# EAGLE board WM1302_915_SPI_without SX1262_SKY66420_v1.3 (EAGLE 6.4), part 1 of 2
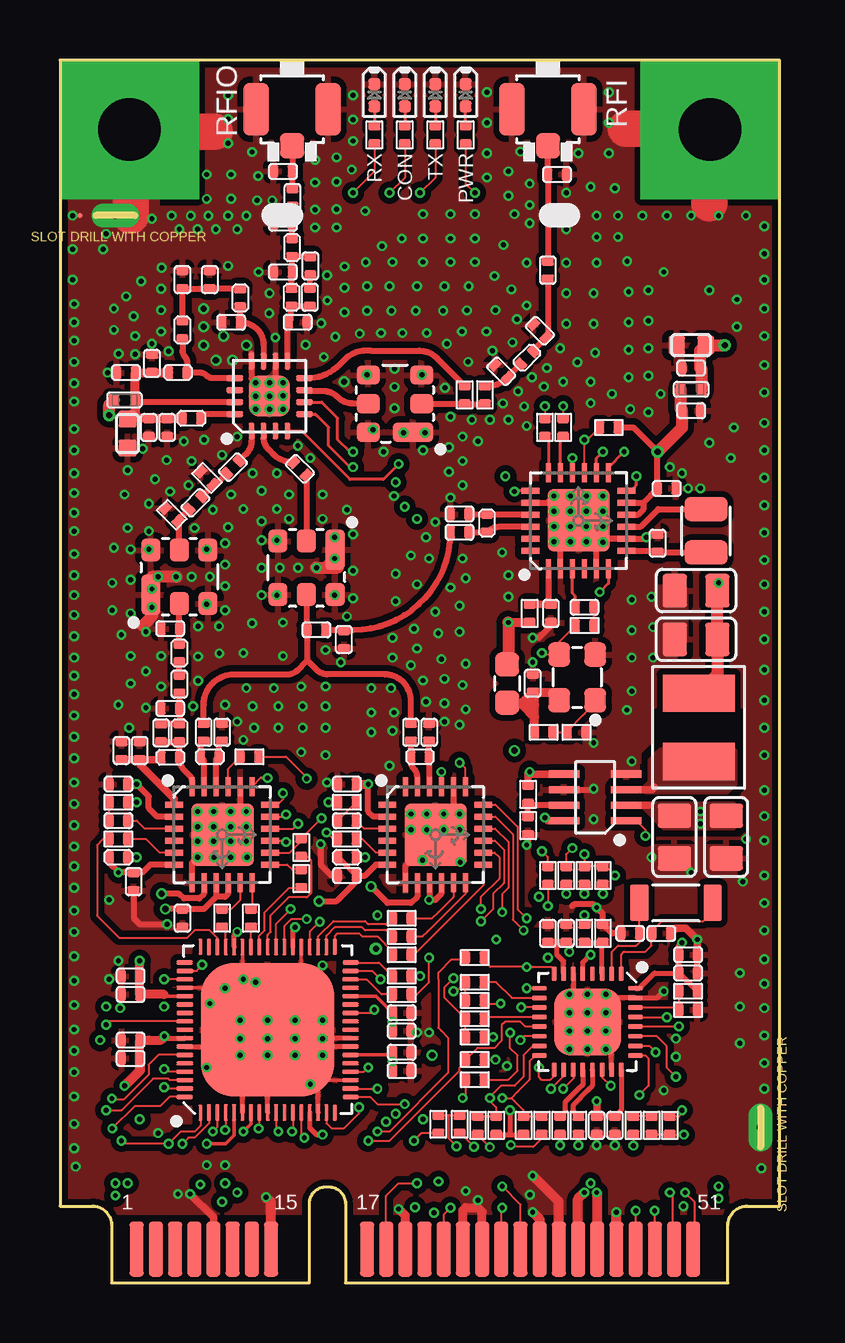
[diagram p5: board, top side]
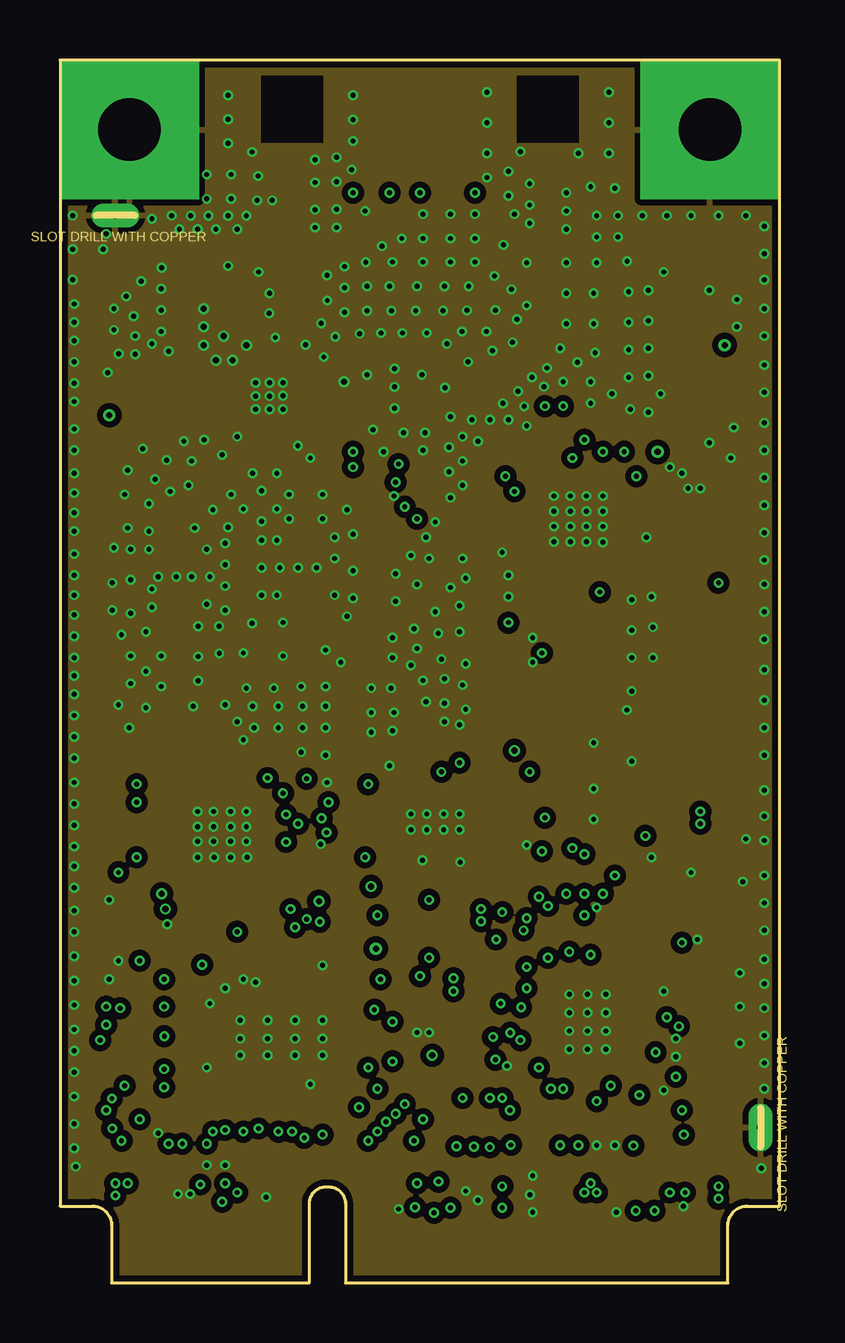
[diagram p6: board, inner layer GND2]
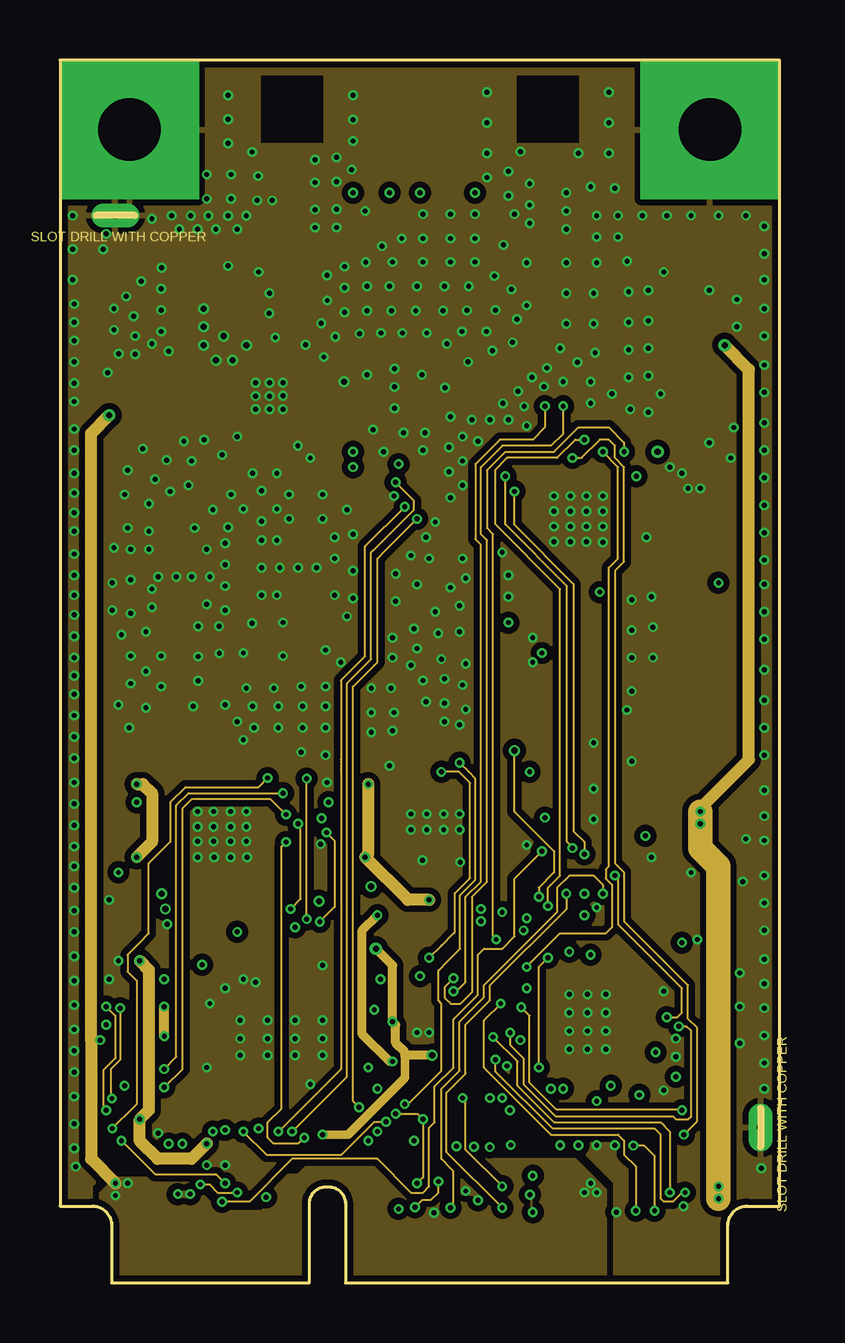
[diagram p7: board, inner layer PWR15]
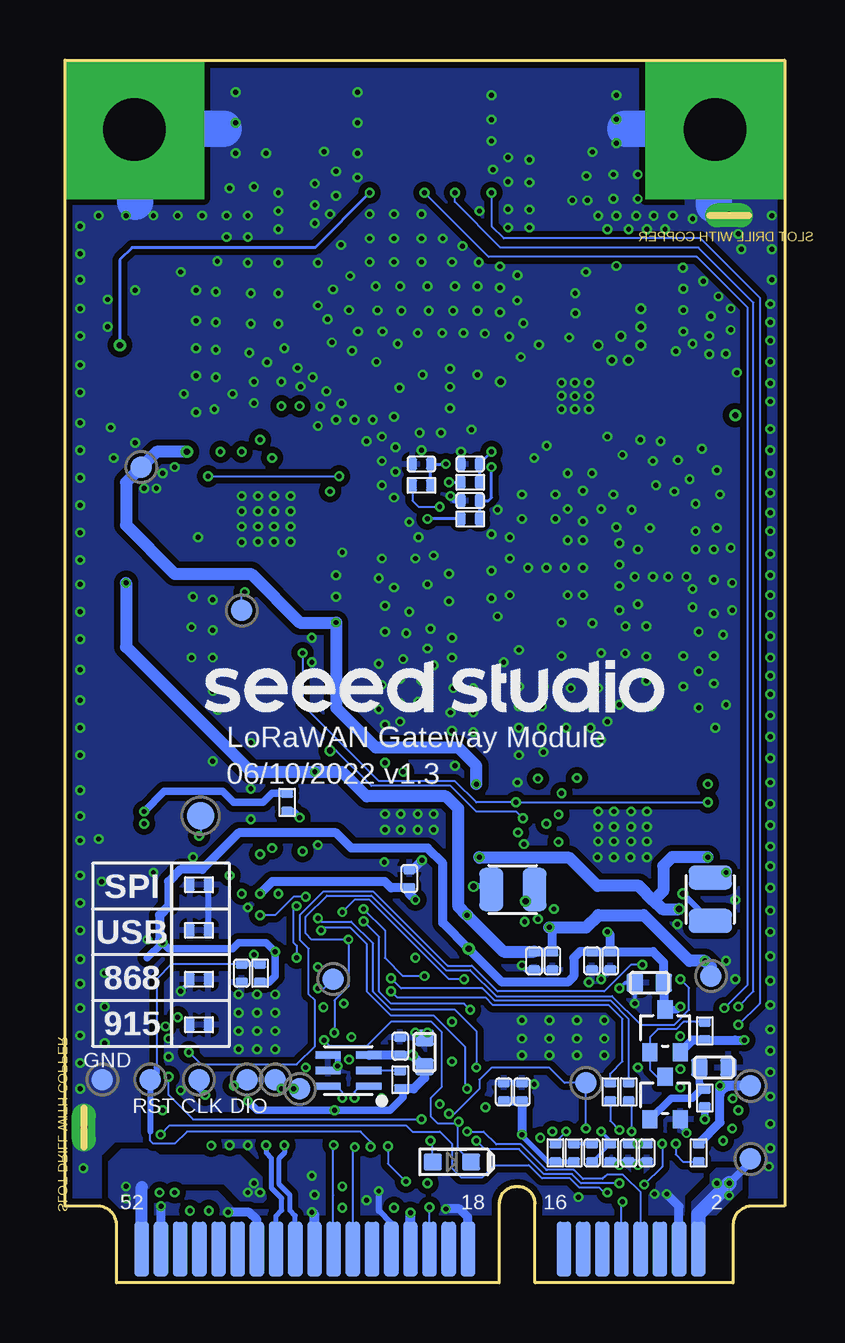
[diagram p8: board, bottom side, seen from below]

Size 30 x 50.95 mm. Coordinates in mm from the lower left corner, seen from the top.
Copper layers (1*2*15*16): Top 0.035mm / dielectric 0.2mm / GND2 0.0175mm / dielectric 0.3mm / PWR15 0.0175mm / dielectric 0.2mm / Bottom 0.035mm
Design rules "SeeedStudio_4layer_DRU_no_angle_20140221 *": minimum track width 1mil, minimum drill 8mil, track to track 3.5mil, track to pad 3.5mil, pad to pad 3.5mil, via to via 3.5mil, smd to smd 0mil, copper to edge 10mil, drill to drill 8mil, minimum pad ring 4mil, minimum via ring 4mil, stop-mask expansion 4mil, vias tented up to drill 25mil, thermal gap 10mil
tRestrict: area 24.9,22.6 to 28.3,23.7; area 20.7,24.1 to 22.4,26.4; area 11.8,9.9 to 12.4,10.1; area 2.1,0 to 27.9,2.6
bRestrict: area 2.1,0 to 27.9,2.6
Milling: area -32.6,37.2 to -23.1,39.1; area -32.6,33.4 to -23.1,36.5; area -32.6,30.8 to -23.1,32.7; 6 lines

## Footprints (pad centres in the part's own frame; a part is rotated, then mirrored left to right if it is on the bottom)
U-FL3P-SMD-2.6X2.6X1.0MM = smd 1.05 x 1: D -1.524,0 | smd 2.2 x 1.05: GND1 0,1.5; GND2 0,-1.5
C0402 = smd 0.385 x 0.508: 1 0.383,0; 2 -0.383,0
C0603 = smd 0.696 x 0.762: 1 0.602,0; 2 -0.602,0
C0805 = smd 1.016 x 1.397: 1 -0.889,0; 2 0.889,0
LED-0402 = smd 0.5 x 0.5: + 0.463,0; - -0.463,0
ESD-0402 = smd 0.385 x 0.508: 1 0.383,0; 2 -0.383,0
SOD-523 = smd 0.762 x 0.7: + 0.8,0; - -0.8,0
F0402 = smd 0.445 x 0.508: 1 -0.445,0; 2 0.445,0
PCIE52P-0.8-50.95X30MM = smd 0.6 x 2.3: 1 0,0; 3 0.8,0; 5 1.6,0; 7 2.4,0; 9 3.2,0; 11 4,0; 13 4.8,0; 15 5.6,0; 17 9.6,0; 19 10.4,0; 21 11.2,0; 23 12,0; 25 12.8,0; 27 13.6,0; 29 14.4,0; 31 15.2,0; 33 16,0; 35 16.8,0; 37 17.6,0; 39 18.4,0; 41 19.2,0; 43 20,0; 45 20.8,0; 47 21.6,0; 49 22.4,0; 51 23.2,0 | smd 0.6 x 2.3 bottom: 2 0.4,0; 4 1.2,0; 6 2,0; 8 2.8,0; 10 3.6,0; 12 4.4,0; 14 5.2,0; 16 6,0; 18 10,0; 20 10.8,0; 22 11.6,0; 24 12.4,0; 26 13.2,0; 28 14,0; 30 14.8,0; 32 15.6,0; 34 16.4,0; 36 17.2,0; 38 18,0; 40 18.8,0; 42 19.6,0; 44 20.4,0; 46 21.2,0; 48 22,0; 50 22.8,0; 52 23.6,0 | drill 2.6 pad 5.8 square: S1 -0.3,46.65; S2 23.9,46.65
L0402 = smd 0.385 x 0.508: 1 0.383,0; 2 -0.383,0
F0603 = smd 1 x 1: 1 -0.8,0; 2 0.8,0
L4.4X3.0MM = smd 1.55 x 3: 1 -1.425,0; 2 1.425,0
L202012 = smd 1 x 1.8: 1 -0.9,0; 2 0.9,0
SOT-323 = smd 0.762 x 0.635: 1 0.889,-0.635; 2 0.889,0.635; 3 -0.889,0
R0402 = smd 0.385 x 0.508: 1 0.383,0; 2 -0.383,0
SHIELD_1302 = smd 0.2 x 0.2: 1 -14.179,19.734
TP_3535 = smd 0.889 x 0.889: T 0,0
TP-D45MIL = smd 1.143 x 1.143: T 0,0
TEST-1.9X0.3MM = drill 0.3 pad 1 long: 1 0,0
QFN68-0.35-7X7X0.75MM = smd 0.68 x 0.18: 1 -3.46,2.8; 17 -3.46,-2.8; 35 3.46,-2.8; 51 3.46,2.8 | smd 0.7 x 0.18: 2 -3.45,2.45; 3 -3.45,2.1; 4 -3.45,1.75; 5 -3.45,1.4; 6 -3.45,1.05; 7 -3.45,0.7; 8 -3.45,0.35; 9 -3.45,0; 10 -3.45,-0.35; 11 -3.45,-0.7; 12 -3.45,-1.05; 13 -3.45,-1.4; 14 -3.45,-1.75; 15 -3.45,-2.1; 16 -3.45,-2.45; 36 3.45,-2.45; 37 3.45,-2.1; 38 3.45,-1.75; 39 3.45,-1.4; 40 3.45,-1.05; 41 3.45,-0.7; 42 3.45,-0.35; 43 3.45,0; 44 3.45,0.35; 45 3.45,0.7; 46 3.45,1.05; 47 3.45,1.4; 48 3.45,1.75; 49 3.45,2.1; 50 3.45,2.45 | smd 0.18 x 0.68: 18 -2.8,-3.46; 34 2.8,-3.46; 52 2.8,3.46; 68 -2.8,3.46 | smd 0.18 x 0.7: 19 -2.45,-3.45; 20 -2.1,-3.45; 21 -1.75,-3.45; 22 -1.4,-3.45; 23 -1.05,-3.45; 24 -0.7,-3.45; 25 -0.35,-3.45; 26 0,-3.45; 27 0.35,-3.45; 28 0.7,-3.45; 29 1.05,-3.45; 30 1.4,-3.45; 31 1.75,-3.45; 32 2.1,-3.45; 33 2.45,-3.45; 53 2.45,3.45; 54 2.1,3.45; 55 1.75,3.45; 56 1.4,3.45; 57 1.05,3.45; 58 0.7,3.45; 59 0.35,3.45; 60 0,3.45; 61 -0.35,3.45; 62 -0.7,3.45; 63 -1.05,3.45; 64 -1.4,3.45; 65 -1.75,3.45; 66 -2.1,3.45; 67 -2.45,3.45 | smd 5.56 x 5.56: 69 0,0
FILTER6P-1.1-3X3X1.3MM = smd 0.81 x 1.7: 1 -1.19,-0.752 | smd 0.81 x 0.96: 2 0,-1.115; 3 1.19,-1.115; 4 1.19,1.115; 5 0,1.115; 6 -1.19,1.115
QFN24G-0.5-4X4MM = smd 0.26 x 0.8: 1 -1.25,-2; 2 -0.75,-2; 3 -0.25,-2; 4 0.25,-2; 5 0.75,-2; 6 1.25,-2; 13 1.25,2; 14 0.75,2; 15 0.25,2; 16 -0.25,2; 17 -0.75,2; 18 -1.25,2 | smd 0.8 x 0.26: 7 2,-1.25; 8 2,-0.75; 9 2,-0.25; 10 2,0.25; 11 2,0.75; 12 2,1.25; 19 -2,1.25; 20 -2,0.75; 21 -2,0.25; 22 -2,-0.25; 23 -2,-0.75; 24 -2,-1.25 | smd 2.6 x 2.6: PAD 0.01,0.02
TSOT23-8 = smd 0.3 x 1.27: 1 -0.975,-1.3; 2 -0.325,-1.3; 3 0.325,-1.3; 4 0.975,-1.3; 5 0.975,1.3; 6 0.325,1.3; 7 -0.325,1.3; 8 -0.975,1.3
MODULE16P-0.5-3X3X0.75MM = smd 0.7 x 0.25: 1 -1.45,0.75; 2 -1.45,0.25; 3 -1.45,-0.25; 4 -1.45,-0.75; 9 1.45,-0.75; 10 1.45,-0.25; 11 1.45,0.25; 12 1.45,0.75 | smd 0.25 x 0.7: 5 -0.75,-1.45; 6 -0.25,-1.45; 7 0.25,-1.45; 8 0.75,-1.45; 13 0.75,1.45; 14 0.25,1.45; 15 -0.25,1.45; 16 -0.75,1.45 | smd 1.7 x 1.7: 17 0,0
UDFN-6L = smd 1.05 x 0.3: 1 -0.85,0.65; 2 -0.85,0; 3 -0.85,-0.65; 4 0.85,-0.65; 5 0.85,0; 6 0.85,0.65
QFN32G-0.4-4X4MM = smd 0.6 x 0.2: 1 -2,1.4; 2 -2,1; 3 -2,0.6; 4 -2,0.2; 5 -2,-0.2; 6 -2,-0.6; 7 -2,-1; 8 -2,-1.4; 17 2,-1.4; 18 2,-1; 19 2,-0.6; 20 2,-0.2; 21 2,0.2; 22 2,0.6; 23 2,1; 24 2,1.4 | smd 0.2 x 0.6: 9 -1.4,-2; 10 -1,-2; 11 -0.6,-2; 12 -0.2,-2; 13 0.2,-2; 14 0.6,-2; 15 1,-2; 16 1.4,-2; 25 1.4,2; 26 1,2; 27 0.6,2; 28 0.2,2; 29 -0.2,2; 30 -0.6,2; 31 -1,2; 32 -1.4,2 | smd 2.8 x 2.8: 33 0,0
X4-SMD-2.5X2.0X1.0MM = smd 1 x 0.9: 1 -0.95,-0.75; 2 0.95,-0.75; 3 0.95,0.75; 4 -0.95,0.75
X2-SMD-3.2X1.5X0.55MM = smd 0.762 x 1.524: 1 -1.524,0; 2 1.524,0

## Placement (x,y rotation side)
ANT1  U.FL-R-SMT-1(10)  [U-FL3P-SMD-2.6X2.6X1.0MM]  9.68,48.9 90 top
ANT2  DNP  [U-FL3P-SMD-2.6X2.6X1.0MM]  20.34,48.9 90 top
C1  100nF  [C0402]  8.03,5.41 90 bottom
C2  1.8pF  [C0402]  4.6,27.26 180 top
C3  10uF  [C0603]  5.64,12.5 180 bottom
C4  56pF  [C0402]  7.21,33.99 225 top
C5  3.6pF  [C0402]  6.76,22.94 90 top
C6  3.6pF  [C0402]  5.99,22.94 90 top
C7  5.6pF  [C0402]  4.6,23.93 180 top
C8  56pF  [C0402]  5.65,32.49 225 top
C9  3.6pF  [C0402]  15.39,22.94 90 top
C10  3.6pF  [C0402]  14.63,22.94 90 top
C11  56pF  [C0402]  10,33.92 315 top
C12  100nF  [C0402]  6.5,5.41 270 bottom
C13  1uF  [C0402]  5.74,5.41 270 bottom
C14  10pF  [C0402]  2.44,19.26 0 top
C16  56pF  [C0402]  15.14,34.12 180 bottom
C17  56pF  [C0402]  13.11,32.59 180 bottom
C18  56pF  [C0402]  13.11,34.12 180 bottom
C19  100nF  [C0402]  11.71,7.95 90 bottom
C20  1uF  [C0402]  10.95,7.95 90 bottom
C21  1uF  [C0402]  2.44,20.78 180 top
C22  DNP  [C0402]  26.31,36.34 0 top
C23  100nF  [C0402]  14.25,9.6 0 top
C24  1uF  [C0402]  14.25,8.84 0 top
C25  100nF  [C0402]  14.25,11.26 0 top
C28  1uF  [C0402]  14.25,10.49 0 top
C29  100nF  [C0402]  9.68,13.41 270 bottom
C30  4.7uF  [C0603]  26.31,39.07 180 top
C31  100nF  [C0402]  26.31,38.12 180 top
C34  470nF  [C0402]  3.07,16.72 270 top
C35  1uF  [C0402]  5.1,15.19 270 top
C36  47nF  [C0402]  3.33,22.18 90 top
C37  47pF  [C0402]  2.56,22.18 90 top
C38  10pF  [C0402]  11.96,19.26 0 top
C39  1uF  [C0402]  11.96,20.78 180 top
C40  1uF  [C0402]  10.44,13.41 270 bottom
C41  100nF  [C0402]  7.26,13.41 270 bottom
C42  1uF  [C0402]  8.03,13.41 270 bottom
C43  100nF  [C0402]  2.95,12.02 180 top
C44  1uF  [C0402]  2.95,12.78 180 top
C45  100nF  [C0402]  2.95,9.35 180 top
C46  470nF  [C0402]  11.96,16.97 180 top
C47  1uF  [C0402]  2.95,10.11 180 top
C48  1uF  [C0402]  15.65,16.84 90 bottom
C49  4.7uF  [C0603]  2.82,35.39 270 top
C50  10nF  [C0402]  2.76,37.93 180 top
C51  1nF  [C0402]  3.71,35.64 270 top
C52  120pF  [C0402]  4.47,35.64 270 top
C53  3pF  [C0402]  4.22,22.91 270 top
C54  39pF  [C0402]  4.98,24.95 270 top
C55  33pF  [C0402]  3.83,38.31 90 top
C56  DNP  [C0402]  6.25,41.8 90 top
C57  10pF  [C0402]  5.1,41.8 90 top
C58  2.4pF  [C0402]  7.14,40.02 180 top
C59  1.8pF  [C0402]  10.42,41.07 90 top
C60  0.5pF  [C0402]  9.91,40.02 180 top
C61  1.8pF  [C0402]  9.3,42.12 0 top
C62  10nF  [C0402]  19.71,24.98 90 top
C63  DNP  [C0402]  24.92,30.81 270 top
C64  56pF  [C0402]  9.69,45.22 270 top
C65  DNP  [C0402]  20.47,27.89 90 top
C66  DNP  [C0402]  21.87,28.15 180 top
C67  DNP  [C0402]  25.3,33.1 180 top
C68  DNP  [C0402]  16.66,31.27 180 top
C69  10uF  [C0805]  27.77,18.57 90 top
C70  10uF  [C0805]  25.62,18.57 90 top
C71  10uF  [C0805]  26.52,28.84 0 top
C72  10uF  [C0805]  26.52,26.81 0 top
C73  DNP  [C0402]  16.66,32.03 0 top
C74  DNP  [C0402]  11.84,26.8 90 top
C75  DNP  [C0402]  10.69,27.21 180 top
C76  DNP  [C0402]  26.19,12.91 0 top
C77  DNP  [C0402]  18.4,37.98 315 top
C78  DNP  [C0402]  20.01,39.67 315 top
C79  DNP  [C0402]  20.34,42.19 270 top
C80  DNP  [C0402]  26.19,13.67 0 top
C81  DNP  [C0402]  25.07,14.56 180 top
C82  DNP  [C0402]  9.3,44.15 0 top
C83  100nF  [C0402]  16.03,9.86 90 bottom
C84  DNP  [C0402]  23.77,14.56 0 top
C85  DNP  [C0402]  22.63,12.91 270 bottom
C86  DNP  [C0402]  21.11,14.56 90 top
C87  DNP  [C0402]  20.34,14.56 90 top
C88  DNP  [C0402]  23.14,6.56 270 top
C89  DNP  [C0402]  22.38,6.56 270 top
C90  2.2uF  [C0603]  15.01,9.6 90 bottom
C91  8.2pF  [C0402]  10.44,42.37 90 top
C92  10uF  [C0603]  2.95,8.97 0 bottom
D1  Green  [LED-0402]  15.65,49.48 270 top
D2  Red  [LED-0402]  14.38,49.48 270 top
D3  Blue  [LED-0402]  13.11,49.48 270 top
D4  Green  [LED-0402]  16.92,49.48 270 top
D5  RClamp1561PQ  [ESD-0402]  9.3,46.31 180 top
D6  DNP  [ESD-0402]  20.73,46.18 0 top
D7  BAT54XV2T1G  [SOD-523]  13.87,5.03 180 bottom
FB1  BLM15PG100SN1D  [F0402]  2.69,36.78 0 top
FB3  BLM15PG100SN1D  [F0402]  26.31,37.23 180 top
J1  DNP  [PCIE52P-0.8-50.95X30MM]  3.2,1.4 0 top
L1  LQP15MN1N2B02D  [L0402]  5.49,36.02 0 top
L2  LQW15AN6N8G00D  [L0402]  4.91,37.93 0 top
L4  0R  [F0603]  18.64,24.97 90 top
L5  LQH44PN1R0NP0L  [L4.4X3.0MM]  26.63,23.15 90 top
L6  MLZ2012M150WT  [L202012]  3.1,15.98 270 bottom
L7  DNP  [L0402]  2.44,17.73 0 top
L8  LQW15AN2N7B00D  [L0402]  5.1,39.7 270 top
L9  LQW15AN47NJ00D  [L0402]  4.6,21.9 0 top
L10  LQW15AN2N5B00D  [L0402]  4.98,22.91 270 top
L11  LQW15AN4N7C00D  [L0402]  4.98,26.24 270 top
L12  LQW15AN12NG00D  [L0402]  6.25,21.92 0 top
L13  LQW15AN12NG00D  [L0402]  15.01,21.92 0 top
L14  MLZ2012M150WT  [L202012]  11.33,16.39 180 bottom
L15  DNP  [L0402]  11.96,17.73 0 top
L16  LQW15AN7N5G00D  [L0402]  7.52,41.04 90 top
L17  LQW15AN4N7C00D  [L0402]  9.66,41.07 270 top
L20  DNP  [L202012]  26.94,31.33 90 top
L21  DNP  [L0402]  19.47,38.55 225 top
L22  DNP  [L0402]  17.8,31.65 90 top
L24  LQW15AN4N7C00D  [L0402]  9.68,43.13 270 top
Q8  CJ2101  [SOT-323]  4.98,10.49 270 bottom
Q10  CJ2102  [SOT-323]  4.98,7.7 270 bottom
R1  10k  [R0402]  7.26,5.41 270 bottom
R3  DNP  [R0402]  20.17,22.94 0 top
R4  10k  [R0402]  21.54,22.94 0 top
R5  100R  [R0402]  6.5,7.95 270 bottom
R6  220R  [R0402]  2.44,20.02 180 top
R9  220R  [R0402]  11.96,20.02 0 top
R10  100R  [R0402]  7.26,7.95 270 bottom
R11  DNP  [R0402]  4.66,32.01 135 top
R12  DNP  [R0402]  6.13,33.53 135 top
R14  100R  [R0402]  15.14,33.23 0 bottom
R15  100R  [R0402]  13.11,31.83 0 bottom
R16  100R  [R0402]  13.11,33.35 0 bottom
R18  0R  [R0402]  14.25,12.02 180 top
R19  0R  [R0402]  14.25,12.78 180 top
R20  0R  [R0402]  14.25,13.67 180 top
R21  0R  [R0402]  14.25,14.43 180 top
R22  0R  [R0402]  14.25,15.19 180 top
R23  0R  [R0402]  11.96,18.49 180 top
R24  0R  [R0402]  7.9,21.92 0 top
R25  0R  [R0402]  10.06,18.14 270 top
R26  0R  [R0402]  10.06,16.84 270 top
R27  0R  [R0402]  7.96,15.19 270 top
R28  0R  [R0402]  6.76,15.19 270 top
R29  0R  [R0402]  2.44,18.49 180 top
R30  680R  [R0402]  15.65,47.83 270 top
R31  680R  [R0402]  14.38,47.83 270 top
R32  680R  [R0402]  13.11,47.83 270 top
R33  10k  [R0402]  3.58,5.41 90 bottom
R34  10k  [R0402]  9.55,5.41 90 bottom
R36  DNP  [R0402]  19.58,27.89 270 top
R37  DNP  [R0402]  21.87,27.38 0 top
R38  DNP  [R0402]  22.88,35.64 180 top
R39  100R  [R0402]  23.9,6.56 90 top
R40  DNP  [R0402]  20.98,35.64 270 top
R41  DNP  [R0402]  20.22,35.64 270 top
R42  DNP  [R0402]  21.87,16.97 90 top
R43  0R  [R0402]  17.3,9.3 180 top
R44  0R  [R0402]  24.66,6.56 270 top
R45  DNP  [R0402]  25.42,6.56 270 top
R46  0R  [R0402]  17.3,10.24 180 top
R47  1k  [R0402]  16.92,47.83 270 top
R48  DNP  [R0402]  17.3,11 180 top
R49  0R  [R0402]  17.3,11.76 180 top
R50  DNP  [R0402]  17.3,12.53 180 top
R51  DNP  [R0402]  22.63,16.97 90 top
R53  DNP  [R0402]  24.41,14.68 0 bottom
R54  DNP  [R0402]  24.41,12.65 0 bottom
R55  0R  [R0402]  24.41,10.75 0 bottom
R56  DNP  [R0402]  26.19,12.14 0 top
R57  DNP  [R0402]  26.19,11.38 180 top
R58  DNP  [R0402]  19.33,6.56 270 top
R59  0R  [R0402]  15.77,6.61 270 top
R60  DNP  [R0402]  20.34,16.97 270 top
R61  DNP  [R0402]  17.3,8.46 0 top
R62  DNP  [R0402]  17.72,36.99 270 top
R63  DNP  [R0402]  21.11,16.97 90 top
R64  DNP  [R0402]  21.61,6.56 270 top
R65  10k  [R0402]  16.03,8.46 270 bottom
R66  DNP  [R0402]  20.85,6.56 270 top
R67  DNP  [R0402]  17.3,13.55 0 top
R68  DNP  [R0402]  18.19,6.56 270 top
R69  0R  [R0402]  16.87,36.99 90 top
R71  DNP  [R0402]  21.87,12.91 270 bottom
R72  DNP  [R0402]  21.87,14.56 90 top
R73  DNP  [R0402]  22.63,14.56 90 top
R74  0R  [R0402]  24.41,16.59 0 bottom
R75  0R  [R0402]  20.09,6.56 90 top
R77  DNP  [R0402]  16.66,6.61 270 top
R78  100k  [R0402]  3.33,10.49 270 bottom
R79  1k  [R0402]  3.33,7.7 270 bottom
R80  10R  [R0402]  8.79,5.41 90 bottom
R81  0R  [R0402]  17.42,6.56 90 top
R82  100k  [R0402]  20.74,20.02 90 bottom
R83  200k_1%  [R0402]  19.52,20.35 270 top
R87  200k_1%  [R0402]  19.52,19.05 270 top
S1  [SHIELD_1302]  15.01,24.73 0 top
TP1  [TP_3535]  1.42,8.21 0 bottom
TP2  [TP_3535]  8.28,8.33 90 bottom
TP3  [TP_3535]  28.44,8.46 0 bottom
TP4  [TP_3535]  1.42,5.16 0 bottom
TP5  [TP_3535]  26.44,8.46 0 bottom
TP7  [TP_3535]  24.41,8.46 90 bottom
TP8  [TP_3535]  22.41,8.46 90 bottom
TP9  [TP_3535]  22.63,28.02 90 bottom
TP10  [TP_3535]  26.82,33.99 0 bottom
TP11  [TP_3535]  21.23,8.46 90 bottom
TP12  [TP_3535]  20.22,8.08 90 bottom
TP13  [TP_3535]  18.82,12.65 90 bottom
TP14  [TP_3535]  3.07,12.78 0 bottom
TP15  [TP-D45MIL]  24.34,19.46 180 bottom
TP16  [TEST-1.9X0.3MM]  2.31,44.48 0 top
TP17  [TEST-1.9X0.3MM]  29.21,6.48 90 top
U1  SX1302IMLTRT  [QFN68-0.35-7X7X0.75MM]  8.66,10.54 90 top
U2  HDF915C1-S6  [FILTER6P-1.1-3X3X1.3MM]  10.27,29.79 180 top
U5  SX1250IMLTRT  [QFN24G-0.5-4X4MM]  6.76,18.67 270 top
U6  MP2161GJ  [TSOT23-8]  22.31,20.22 90 top
U7  SX1250IMLTRT  [QFN24G-0.5-4X4MM]  15.65,18.67 270 top
U8  HDF915C1-S6  [FILTER6P-1.1-3X3X1.3MM]  4.98,29.42 0 top
U9  SKY66420-11  [MODULE16P-0.5-3X3X0.75MM]  8.74,36.94 90 top
U10  HDF915C1-S6  [FILTER6P-1.1-3X3X1.3MM]  13.96,36.63 90 top
U11  DNP  [QFN24G-0.5-4X4MM]  21.61,31.75 0 top
U13  STTS751  [UDFN-6L]  18.19,8.84 180 bottom
U14  N32G4FRKEQ7  [QFN32G-0.4-4X4MM]  22,10.87 270 top
U$33  [LOGO-SEEED-NEW-2_1X19.1MM]  24.16,23.83 0 bottom
X1  DSB221SDN  [X4-SMD-2.5X2.0X1.0MM]  21.56,25.23 90 top
X3  DNP  [X2-SMD-3.2X1.5X0.55MM]  25.68,15.83 0 top